# Altium schematic sheet SensingCables.SchDoc: Sensing Cable Wiring Diagram
size A4; CompanyName: UofT Capstone Team 2024991; DrawnBy: Tony Kim; Revision: 1; SheetNumber: 2; SheetTotal: 2
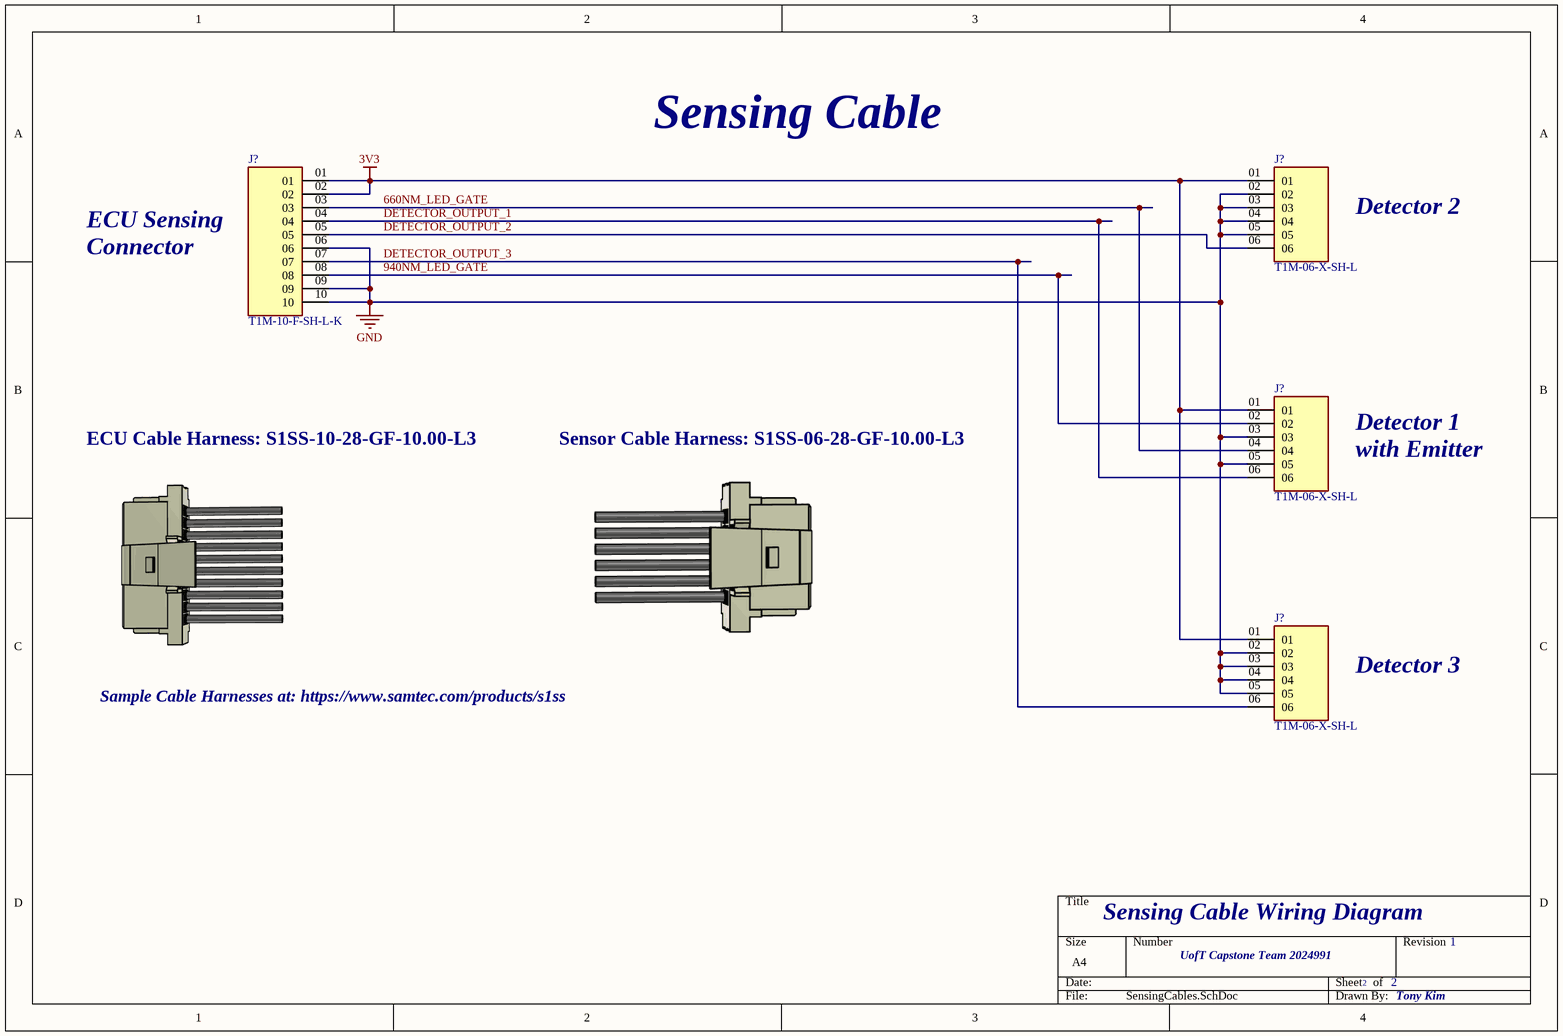
[diagram p0: SensingCables.SchDoc]

## Parts
(Parts that share a designator on the sheet are numbered #1, #2 ... from top to bottom, then left to right.)
J?#1  T1M-06-X-SH-L  [SAMTEC_T1M-06-X-SH-L]
J?#2  T1M-10-F-SH-L-K  [SAMTEC_T1M-10-F-SH-L-K]
J?#3  T1M-06-X-SH-L  [SAMTEC_T1M-06-X-SH-L]
J?#4  T1M-06-X-SH-L  [SAMTEC_T1M-06-X-SH-L]

## Nets
3V3: J?#1.01 J?#2.01 J?#2.02 J?#3.01 J?#4.01
GND: J?#1.02 J?#1.03 J?#1.04 J?#1.05 J?#2.06 J?#2.09 J?#2.10 J?#3.03 J?#3.05 J?#4.02 J?#4.03 J?#4.04 J?#4.05
660NM_LED_GATE: J?#2.03 J?#3.04
940NM_LED_GATE: J?#2.08 J?#3.02
DETECTOR_OUTPUT_1: J?#2.04 J?#3.06
DETECTOR_OUTPUT_2: J?#1.06 J?#2.05
DETECTOR_OUTPUT_3: J?#2.07 J?#4.06

## Notes on the sheet
- Sensing Cable
- ECU Sensing
- Detector 2
- Connector
- ECU Cable Harness: S1SS-10-28-GF-10.00-L3
- Sensor Cable Harness: S1SS-06-28-GF-10.00-L3
- Detector 1
- with Emitter
- Sample Cable Harnesses at: https://www.samtec.com/products/s1ss
- Detector 3

## Library data of the parts
J?#1 J?#3 J?#4 = T1M-06-X-SH-L: Connector Header Surface Mount, Right Angle 6 position 0.039" (1.00mm); MF: Samtec; Availability: Unavailable; Value: *; Price: None; MP: T1M-06-X-SH-L; Package: None
J?#2 = T1M-10-F-SH-L-K: MF: Samtec; Value: *; Package: None; MP: T1M-10-F-SH-L-K; Price: None; Availability: Unavailable